# Altium schematic sheet pid.SchDoc
size A4; DrawnBy: Marco Canteri
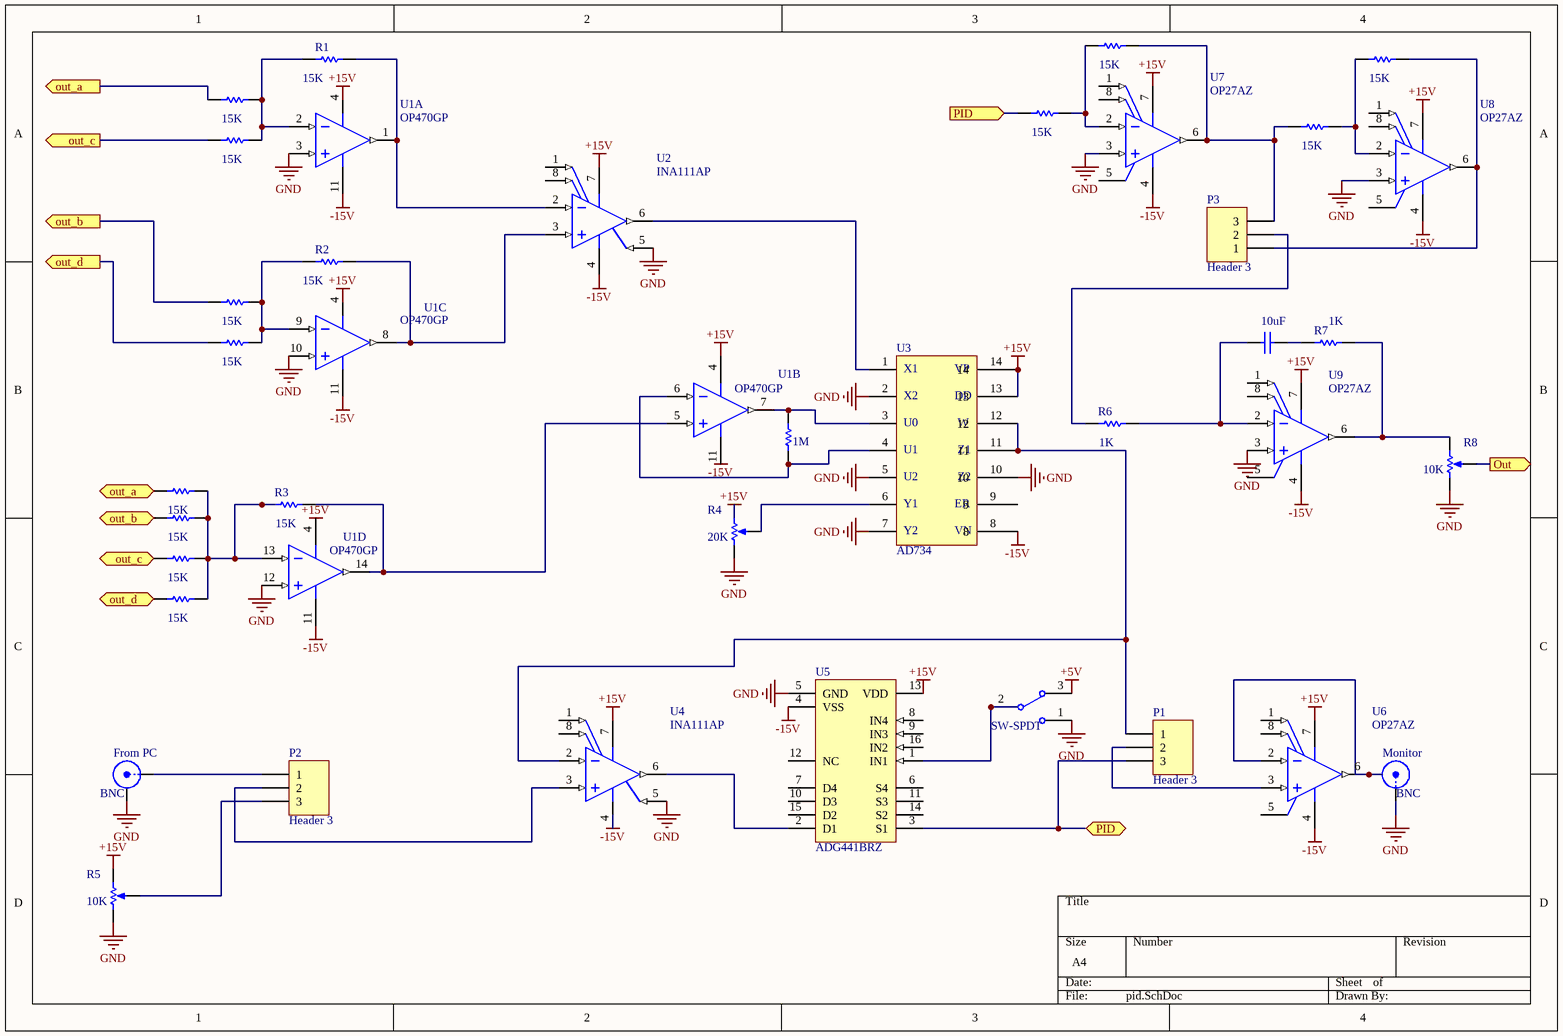
[diagram p0: pid.SchDoc]

## Parts
(Parts that share a designator on the sheet are numbered #1, #2 ... from top to bottom, then left to right.)
C1  value 10uF  [RAD-0.3]  (hidden comment: Cap)
From_PC  BNC  [BNC_RA CON]
Monitor  BNC  [BNC_RA CON]
P1  Header 3  [HDR1X3]
P2  Header 3  [HDR1X3]
P3  Header 3  [HDR1X3]
R1  value 15K  [AXIAL-0.3]  (hidden comment: Res1)
R2  value 15K  [AXIAL-0.3]  (hidden comment: Res1)
R3  value 15K  [AXIAL-0.3]  (hidden comment: Res1)
R4  value 20K  [VR5]  (hidden comment: RPot)
R5  value 10K  [VR5]  (hidden comment: RPot)
R6  value 1K  [AXIAL-0.3]  (hidden comment: Res1)
R7  value 1K  [AXIAL-0.3]  (hidden comment: Res1)
R8  value 10K  [VR5]  (hidden comment: RPot)
R?#1  value 15K  [AXIAL-0.3]  (hidden comment: Res1)
R?#2  value 15K  [AXIAL-0.3]  (hidden comment: Res1)
R?#3  value 15K  [AXIAL-0.3]  (hidden comment: Res1)
R?#4  value 15K  [AXIAL-0.3]  (hidden comment: Res1)
R?#5  value 15K  [AXIAL-0.3]  (hidden comment: Res1)
R?#6  value 15K  [AXIAL-0.3]  (hidden comment: Res1)
R?#7  value 15K  [AXIAL-0.3]  (hidden comment: Res1)
R?#8  value 15K  [AXIAL-0.3]  (hidden comment: Res1)
R?#9  value 1M  [AXIAL-0.3]  (hidden comment: Res1)
R?#10  value 15K  [AXIAL-0.3]  (hidden comment: Res1)
R?#11  value 15K  [AXIAL-0.3]  (hidden comment: Res1)
R?#12  value 15K  [AXIAL-0.3]  (hidden comment: Res1)
R?#13  value 15K  [AXIAL-0.3]  (hidden comment: Res1)
S?  SW-SPDT  [TL36WW15050]
U1  OP470GP  [ADI-N-14]  (parts A,B,C,D of 4)
U2  INA111AP  [TI-P8]
U3  AD734
U4  INA111AP  [TI-P8]
U5  ADG441BRZ  [ADI-R-16_N]
U6  OP27AZ  [ADI-Q-8]
U7  OP27AZ  [ADI-Q-8]
U8  OP27AZ  [ADI-Q-8]
U9  OP27AZ  [ADI-Q-8]

## Ports
Out (out), out_a (out), out_b (out), out_c (out), out_d (out), PID (in), PID (out)

## Nets
+5V: S?.3
+15V: R4.2(BOT) R5.2(BOT) U1.4(+V) U2.7(V+) U3.13 U3.14 U4.7(V+) U5.13(VDD) U6.7(+V) U7.7(+V) U8.7(+V) U9.7(+V)
-15V: U1.11(-V) U2.4(V-) U3.8 U4.4(V-) U5.4(VSS) U6.4(-V) U7.4(-V) U8.4(-V) U9.4(-V)
GND: From_PC.2(Y) Monitor.1(X) R4.1(TOP) R5.1(TOP) R8.1(TOP) S?.1 U1.3(+IN_A) U1.10(+IN_C) U1.12(+IN_D) U2.5(REF) U3.10 U4.5(REF) U5.5(GND) U7.3(+IN) U8.3(+IN) U9.3(+IN)
Out: R8.3(TAP) ; port Out
out_a: R?#3.1 R?#10.1 ; port out_a
out_b: R?#7.1 R?#11.1 ; port out_b
out_c: R?#6.1 R?#12.1 ; port out_c
out_d: R?#8.1 R?#13.1 ; port out_d
PID: R?#4.1 ; port PID
NetC1_1: C1.1 R6.2 U9.2(-IN)
NetC1_2: C1.2 R7.1
NetFrom_PC_1: From_PC.1(X) P2.1
NetMonitor_2: Monitor.2(Y) U6.2(-IN) U6.6(OUT)
NetP1_1: P1.1 U3.11 U3.12 U4.2(VIN-)
NetP1_2: P1.2 U6.3(+IN)
NetP1_3: P1.3 U5.3(S1)
NetP2_2: P2.2 U4.3(VIN+)
NetP2_3: P2.3 R5.3(TAP)
NetP3_1: P3.1 R?#2.2 U8.6(OUT)
NetP3_2: P3.2 R6.1
NetP3_3: P3.3 R?#1.2 R?#5.1 U7.6(OUT)
NetR1_1: R1.1 R?#3.2 R?#6.2 U1.2(-IN_A)
NetR1_2: R1.2 U1.1(OUT_A) U2.2(VIN-)
NetR2_1: R2.1 R?#7.2 R?#8.2 U1.9(-IN_C)
NetR2_2: R2.2 U1.8(OUT_C) U2.3(VIN+)
NetR3_1: R3.1 R?#10.2 R?#11.2 R?#12.2 R?#13.2 U1.13(-IN_D)
NetR3_2: R3.2 U1.5(+IN_B) U1.14(OUT_D)
NetR7_2: R7.2 R8.2(BOT) U9.6(OUT)
NetR?#1_1: R?#1.1 R?#4.2 U7.2(-IN)
NetR?#2_1: R?#2.1 R?#5.2 U8.2(-IN)
NetR?#9_1: R?#9.1 U1.6(-IN_B)
NetR?#9_2: R?#9.2 U1.7(OUT_B)
NetS?_2: S?.2 U5.1(IN1)
NetU4_6: U4.6(VO) U5.2(D1)

Not connected (* = marked no-connect by the designer): R4 3(TAP); U2 1(RG) 6(VO) 8(RG); U3 1 2 3 4 5 6 7 9; U4 1(RG) 8(RG); U5 6(S4) 7(D4) 8(IN4) 9(IN3) 10(D3) 11(S3) 12(NC) 14(S2) 15(D2) 16(IN2); U6 1(VOS_TRIM) 5(NC) 8(VOS_TRIM); U7 1(VOS_TRIM) 5(NC) 8(VOS_TRIM); U8 1(VOS_TRIM) 5(NC) 8(VOS_TRIM); U9 1(VOS_TRIM) 5(NC) 8(VOS_TRIM)

## Notes on the sheet
- Labels drawn without touching a wire or pin: +15V, -15V, GND
- (in symbol AD734) X1; VP; X2; DD; U0; W; U1; Z1; U2; Z2; Y1; ER; Y2; VN

## Library data of the parts
C1 = Cap: Capacitor; Published: 8-Jun-2000; LatestRevisionDate: 17-Jul-2002; LatestRevisionNote: Re-released for DXP Platform.; PackageReference: RAD-0.3; Publisher: Altium Limited; PackageDescription: Radial Cap, Thru-Hole; 2 Leads; 0.3 in Pin Spacing
From_PC Monitor = BNC: BNC Elbow Connector; LatestRevisionDate: 17-Jul-2002; LatestRevisionNote: Re-released for DXP Platform.; Publisher: Altium Limited
P1-P3 = Header 3: Header, 3-Pin; LatestRevisionDate: 17-Jul-2002; LatestRevisionNote: Re-released for DXP Platform.; Publisher: Altium Limited
R1-R3 R6 R7 R?#1-R?#13 = Res1: Resistor; Published: 8-Jun-2000; LatestRevisionDate: 17-Jul-2002; LatestRevisionNote: Re-released for DXP Platform.; PackageReference: AXIAL-0.3; Publisher: Altium Limited; PackageDescription: Axial Device, Thru-Hole; 2 Leads; 0.3 in Pin Spacing
R4 R5 R8 = RPot: Potentiometer; Sim Note: Enter the Resistance value and the set point into parameter fields.; Set Position: 0.5; Published: 8-Jun-2000; LatestRevisionDate: 17-Jul-2002; LatestRevisionNote: Re-released for DXP Platform.; PackageReference: VR5; Publisher: Altium Limited; PackageDescription: Variable Resistor, Thru-Hole; 3 Leads
S? = SW-SPDT: SPDT Subminiature Toggle Switch, Right Angle Mounting, Vertical Actuation; Published: 24-Mar-1999; LatestRevisionDate: 17-Dec-2003; LatestRevisionNote: Schematic revised, PCB Footprint replaced.; DatasheetVersion: 05-Dec-2000; PackageReference: TL36WW15050; Publisher: Altium Limited; PackageDescription: Switch; 4 Leads; ComponentLink1Description: Manufacturer Link; ComponentLink1URL: http://www.apem.com
U1 = OP470GP: Quad Channel Low Offset Voltage Drift Operational Amplifier, 6 MHz BW, 2 V/us SR, Industrial, 14-pin DIP (N-14), Tube; Generic Part Number: OP470; Manufacturer: Analog Devices; Amplifiers Per Package: 4; Input Bias Current: 25nA; Input Offset Voltage: 400uV; Iq/Amp: 2.75mA; Slew Rate: 2V/us; Small Signal Bandwidth: 6MHz; V Span Max: 36V; V Span Min: 9V; DatasheetVersion: Rev. B; PackageVersion: 070606-A; PackageReference: N-14; PackageDescription: 14-Pin Plastic Dual In-Line Package, Row spacing 7.62 mm, Pitch 2.54 mm; Supplier 1: Digi-Key; Supplier Part Number 1: OP470GP-ND; Supplier 2: Newark; Supplier Part Number 2: 05F8708; Packing: Tube; Mounting Technology: Through Hole; Code_JEDEC: MS-001; PartNumber: OP470GP; ComponentLink1Description: Manufacturer URL; ComponentLink1URL: http://www.analog.com/en/index.html; ComponentLink2Description: Datasheet; ComponentLink2URL: http://www.analog.com/static/imported-files/data_sheets/OP470.pdf; ComponentLink3Description: Package Specification; ComponentLink3URL: http://www.analog.com/static/imported-files/packages/N_14.pdf
U2 U4 = INA111AP: High Speed FET-Input Instrumentation Amplifier, -40 to 85 degC, 8-pin DIP (P8), Green (RoHS & no Sb/Br); Manufacturer: Texas Instruments; CMRR(Min)(dB): 100; Gain(V/V): 1 to 10000; Input Bias Current (+/-)(Max)(nA): 0.02; Input Offset (+/-)(Max)(uV): 1000; Input Offset Drift (+/-)(Max)(uV/Degrees Celsius): 10; Non-Linearity (+/-)(Max)(%): 0.01; Number of Channels: 1; Quiescent Current (+/-)(Typ)(mA): 3.3; SubFamily: Dual Supply; Vs(Max)(V): 36; Vs(Min)(V): 12; DatasheetVersion: SBOS015; PackageVersion: 4040082/E, 04/2010; PackageReference: P8; PackageDescription: 8-Pin Plastic In-Line, Body 9.59 x 6.35 mm, Pitch 2.54 mm; Supplier 1: Digi-Key; Supplier Part Number 1: INA111AP-ND; Supplier 2: Newark; Supplier Part Number 2: 74K3808; Supplier 3: Mouser; Supplier Part Number 3: 595-INA111AP; Eco-Plan: Green (RoHS & no Sb/Br); Noise at 1kHz(Typ)(nV/rt(Hz)): 10; Mounting Technology: Through Hole; Code_JEDEC: MS-001; PartNumber: INA111AP; ComponentLink1Description: Manufacturer URL; ComponentLink1URL: http://www.ti.com/; ComponentLink2Description: Datasheet; ComponentLink2URL: http://www.ti.com/general/docs/lit/getliterature.tsp?genericPartNumber=INA111&fileType=pdf; ComponentLink3Description: Package Specification; ComponentLink3URL: http://www.ti.com/litv/pdf/mpdi001b
U5 = ADG441BRZ: LC2MOS Quad SPST Switches, 40 Ohm Ron, 16-pin SOIC (R-16), Tube; Manufacturer: Analog Devices; # Sw Functions: 4; Max Neg Supply: -16.5V; Max Pos Supply: +16.5V; Ron (ohms): 40, 70; t ON: 85ns, 105ns; DatasheetVersion: Rev. A; PackageVersion: 060606-A, 06/2006; PackageReference: R-16; PackageDescription: 16-Pin Standard Small Outline Package, Body 9.9 x 3.9 mm, Pitch 1.27 mm; Supplier 1: Digi-Key; Supplier Part Number 1: ADG441BRZ-ND; Supplier 2: Farnell; Supplier Part Number 2: 1661026; Supplier 3: Newark; Supplier Part Number 3: 19M8655; Supplier 4: Mouser; Supplier Part Number 4: 584-ADG441BRZ; Configuration: SPST; Packing: Tube; Mounting Technology: Surface Mount; Code_JEDEC: MS-012-AC; PartNumber: ADG441BRZ; ComponentLink1Description: Manufacturer URL; ComponentLink1URL: http://www.analog.com/en/index.html; ComponentLink2Description: Datasheet; ComponentLink2URL: http://www.analog.com/static/imported-files/data_sheets/ADG441_442_444.pdf; ComponentLink3Description: Package Specification; ComponentLink3URL: http://www.analog.com/static/imported-files/packages/PKG_PDF/SOIC_Narrow%20(R)/R_16.pdf
U6-U9 = OP27AZ: Single Channel Low Noise Operational Amplifier, 8 MHz BW, 2.8 V/us SR, Industrial, 8-pin DIP (Q-8), Tube; Generic Part Number: OP27; Manufacturer: Analog Devices; Amplifiers Per Package: 1; Input Bias Current: 15nA; Input Offset Voltage: 30uV; Iq/Amp: 5.7mA; Small Signal Bandwidth: 8MHz; V Span Max: 44V; V Span Min: 8V; DatasheetVersion: Rev. F; PackageReference: Q-8; PackageDescription: 8-Pin Ceramic Dual In-Line Package, Row spacing 7.62 mm, Pitch 2.54 mm; Supplier 1: Digi-Key; Supplier Part Number 1: OP27AZ-ND; Supplier 2: Farnell; Supplier Part Number 2: 5058806; Supplier 3: Newark; Supplier Part Number 3: 07C8653; Packing: Tube; Slew Rate: 2.8V/us; Mounting Technology: Through Hole; PartNumber: OP27AZ; ComponentLink1Description: Manufacturer URL; ComponentLink1URL: http://www.analog.com/en/index.html; ComponentLink2Description: Datasheet; ComponentLink2URL: http://www.analog.com/static/imported-files/data_sheets/OP27.pdf; ComponentLink3Description: Package Specification; ComponentLink3URL: http://www.analog.com/static/imported-files/packages/3925655241313314758Q_8.pdf